# EAGLE design receptept (EAGLE 8.6.3)
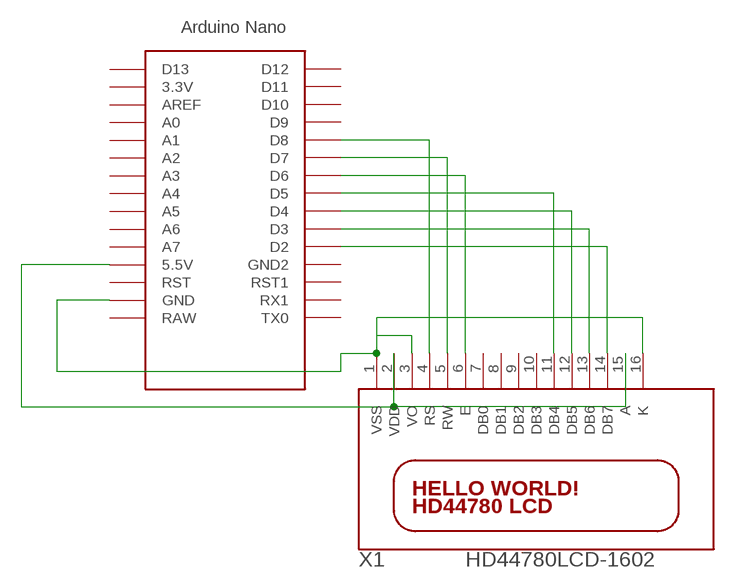
[diagram p0: schematic, sheet 1]

## Parts
U$1  NANO  [NANO]
X1  HD44780LCD-1602  [LCD1602]

## Nets
N$1: U$1.D8 X1.4(RS)
N$2: U$1.D7 X1.5(RW)
N$3: U$1.D6 X1.6(E)
N$4: U$1.D5 X1.11(DB4)
N$5: U$1.D4 X1.12(DB5)
N$6: U$1.D3 X1.13(DB6)
N$7: U$1.D2 X1.14(DB7)
VDD: U$1.5V(5.5V) X1.2(VDD) X1.15(A)
VSS: U$1.GND X1.1(VSS) X1.3(VO) X1.16(K)
Unconnected: U$1.3.3V U$1.A0 U$1.A1 U$1.A2 U$1.A3 U$1.A4 U$1.A5 U$1.A6 U$1.A7 U$1.AREF U$1.D9 U$1.D10 U$1.D11 U$1.D12 U$1.D13 U$1.GND1(GND2) U$1.ICSP1 U$1.ICSP2 U$1.ICSP3 U$1.ICSP4 U$1.ICSP5 U$1.ICSP6 U$1.RAW U$1.RST U$1.RST1 U$1.RX1 U$1.TX0 X1.7(DB0) X1.8(DB1) X1.9(DB2) X1.10(DB3)

## Library data of the parts
U$1 = Arduino-clone:NANO: Arduino Nano
X1 = adafruit:HD44780LCD: HD44780 LCD Standard character type LCDs, available in sizes from 8x1 to 40x4!

## Board
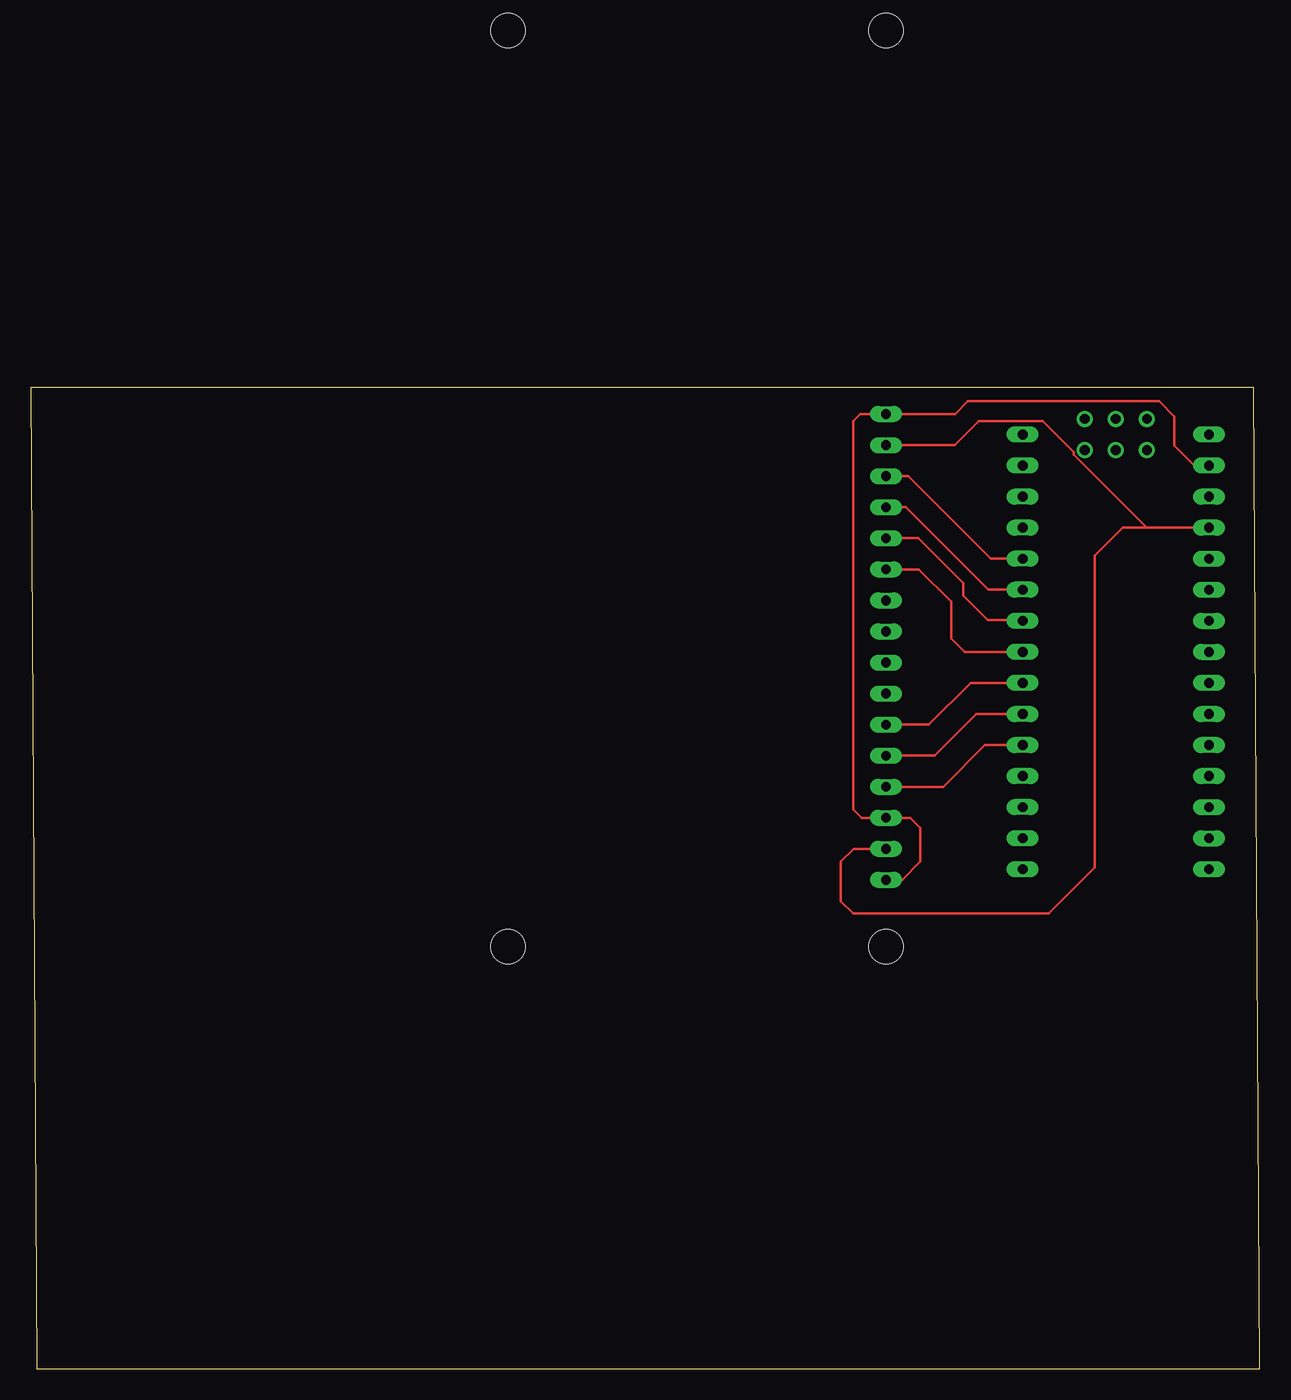
[diagram p1: board, top side]
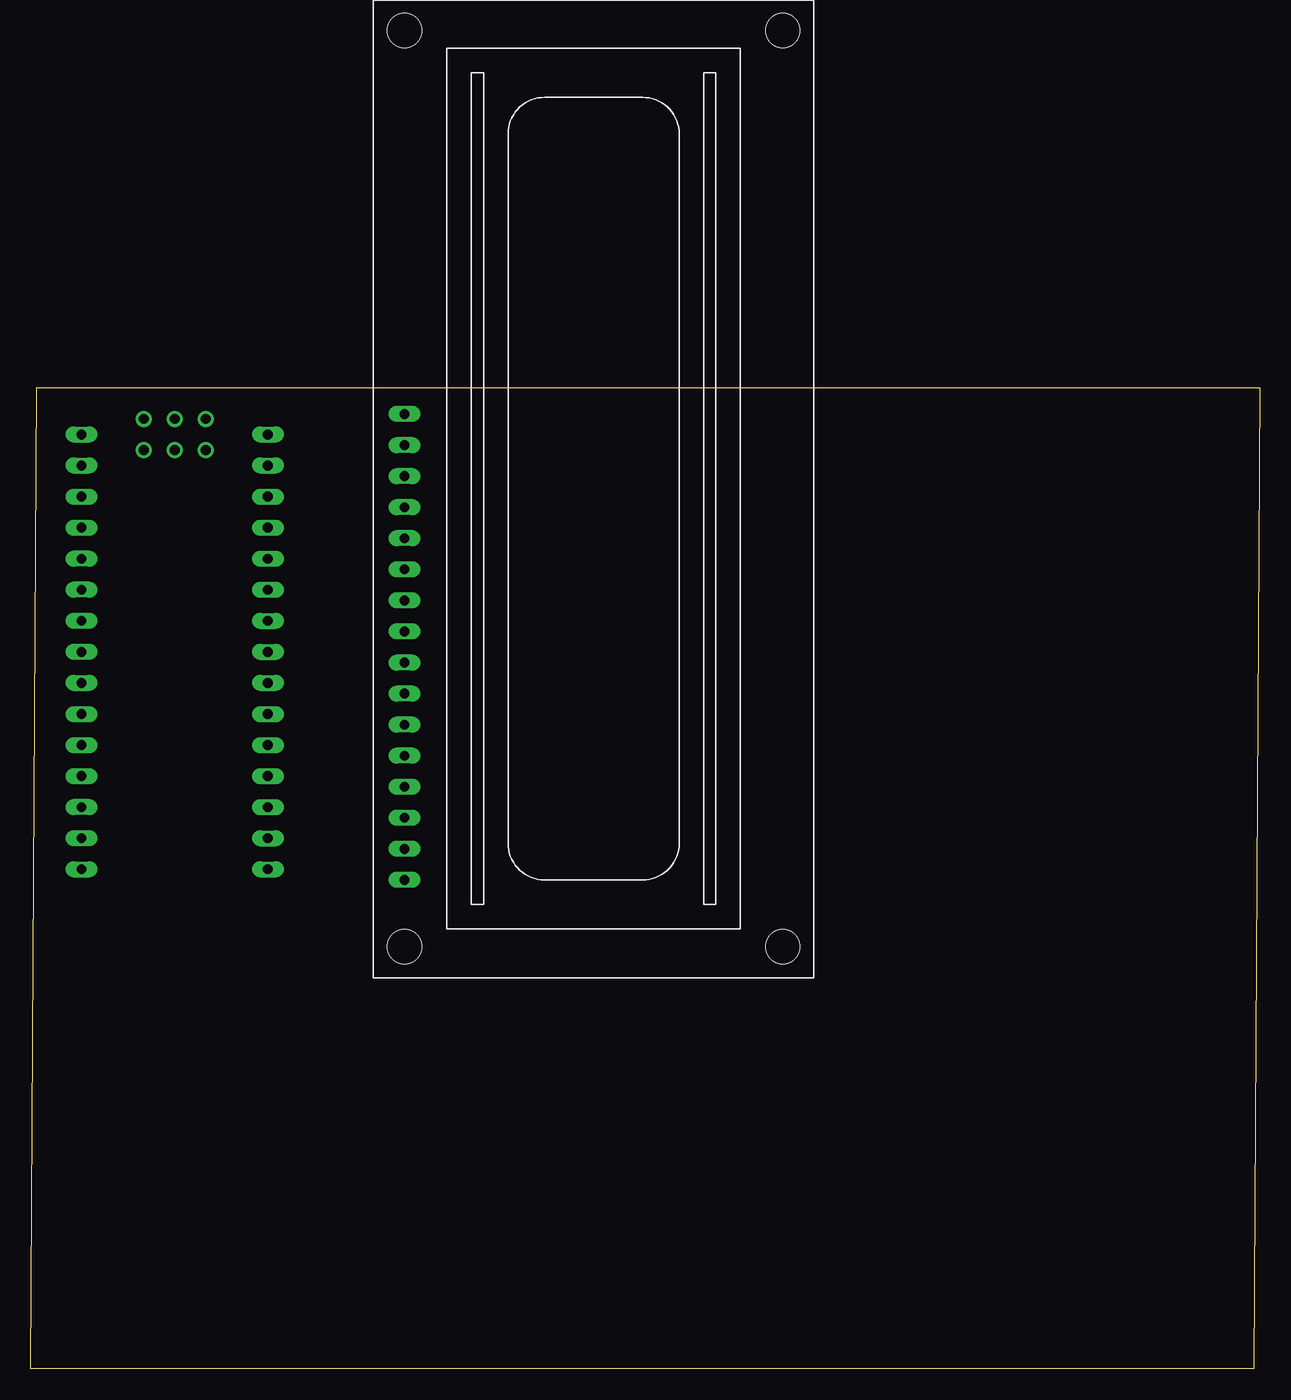
[diagram p2: board, bottom side, seen from below]

Size 100.5 x 80.25 mm. Coordinates in mm from the lower left corner, seen from the top.
Outline: 0.5,0 100.5,0 100,80.25 0,80.25 0.5,0
Copper layers (1*16): Top 0.035mm / dielectric 1.5mm / Bottom 0.035mm
Design rules "default": minimum track width 6mil, minimum drill 0.35mm, track to track 6mil, track to pad 6mil, pad to pad 6mil, via to via 6mil, smd to smd 6mil, copper to edge 40mil, drill to drill 6mil, minimum pad ring 10mil, minimum via ring 8mil, stop-mask expansion 4mil, vias tented up to drill 0mil, thermal gap 10mil

### Footprints (pad centres in the part's own frame; a part is rotated, then mirrored left to right if it is on the bottom)
NANO = drill 0.8 long: 3.3V -10.16,24.13; 5V -10.16,-1.27; A0 -10.16,19.05; A1 -10.16,16.51; A2 -10.16,13.97; A3 -10.16,11.43; A4 -10.16,8.89; A5 -10.16,6.35; A6 -10.16,3.81; A7 -10.16,1.27; AREF -10.16,21.59; D2 5.08,1.27; D3 5.08,3.81; D4 5.08,6.35; D5 5.08,8.89; D6 5.08,11.43; D7 5.08,13.97; D8 5.08,16.51; D9 5.08,19.05; D10 5.08,21.59; D11 5.08,24.13; D12 5.08,26.67; D13 -10.16,26.67; GND -10.16,-6.35; GND1 5.08,-1.27; RAW -10.16,-8.89; RST -10.16,-3.81; RST1 5.08,-3.81; RX1 5.08,-6.35; TX0 5.08,-8.89 | drill 0.8: ICSP1 -5.08,-10.16; ICSP2 -5.08,-7.62; ICSP3 -2.54,-10.16; ICSP4 -2.54,-7.62; ICSP5 0,-10.16; ICSP6 0,-7.62
LCD1602 = drill 0.8 long: 1 8,33.46; 2 10.54,33.46; 3 13.08,33.46; 4 15.62,33.46; 5 18.16,33.46; 6 20.7,33.46; 7 23.24,33.46; 8 25.78,33.46; 9 28.32,33.46; 10 30.86,33.46; 11 33.4,33.46; 12 35.94,33.46; 13 38.48,33.46; 14 41.02,33.46; 15 43.56,33.46; 16 46.1,33.46 | hole 2.8: 2.54,2.54; 2.54,33.46; 77.46,33.46; 77.46,2.54

### Placement (x,y rotation side)
U$1  86.18,67.53 180 top
X1  36.47,31.99 90 bottom

### Tracks (layer width: path | path; a pad name or v marks a point on that pad's centre or on a via)
N$1
  Top 0.203: X1.4 74.61,47.61 78.02,51.02 U$1.D8
N$2
  Top 0.203: X1.5 73.9,50.15 77.31,53.56 U$1.D7
N$3
  Top 0.203: X1.6 73.44,52.69 76.85,56.1 U$1.D6
N$4
  Top 0.203: U$1.D5 76.36,58.64 75.25,59.75 75.25,62.75 72.61,65.39 X1.11
N$5
  Top 0.203: U$1.D4 81.03,61.25 78.25,61.25 76.25,63.25 76.25,64.25 72.57,67.93 X1.12
N$6
  Top 0.203: U$1.D3 78.28,63.72 71.53,70.47 X1.13
N$7
  Top 0.203: U$1.D2 78.49,66.26 71.74,73.01 X1.14
VDD
  Top 0.203: X1.2 67.28,42.53 66.25,41.5 66.25,38.25 67.25,37.25 83.25,37.25 87,41 87,66.5 89.3,68.8 U$1.5V 91.25,68.8 85.27,74.77 85.27,74.98 82.75,77.5 77.5,77.5 75.55,75.55 X1.15
VSS
  Top 0.203: X1.1 71.24,39.99 72.75,41.5 72.75,44.25 71.93,45.07 70.25,45.07 X1.3 67.93,45.07 67.25,45.75 67.25,77.5 67.84,78.09 X1.16 75.59,78.09 76.63,79.13 92.25,79.13 93.5,77.88 93.5,75.5 95.12,73.88 U$1.GND